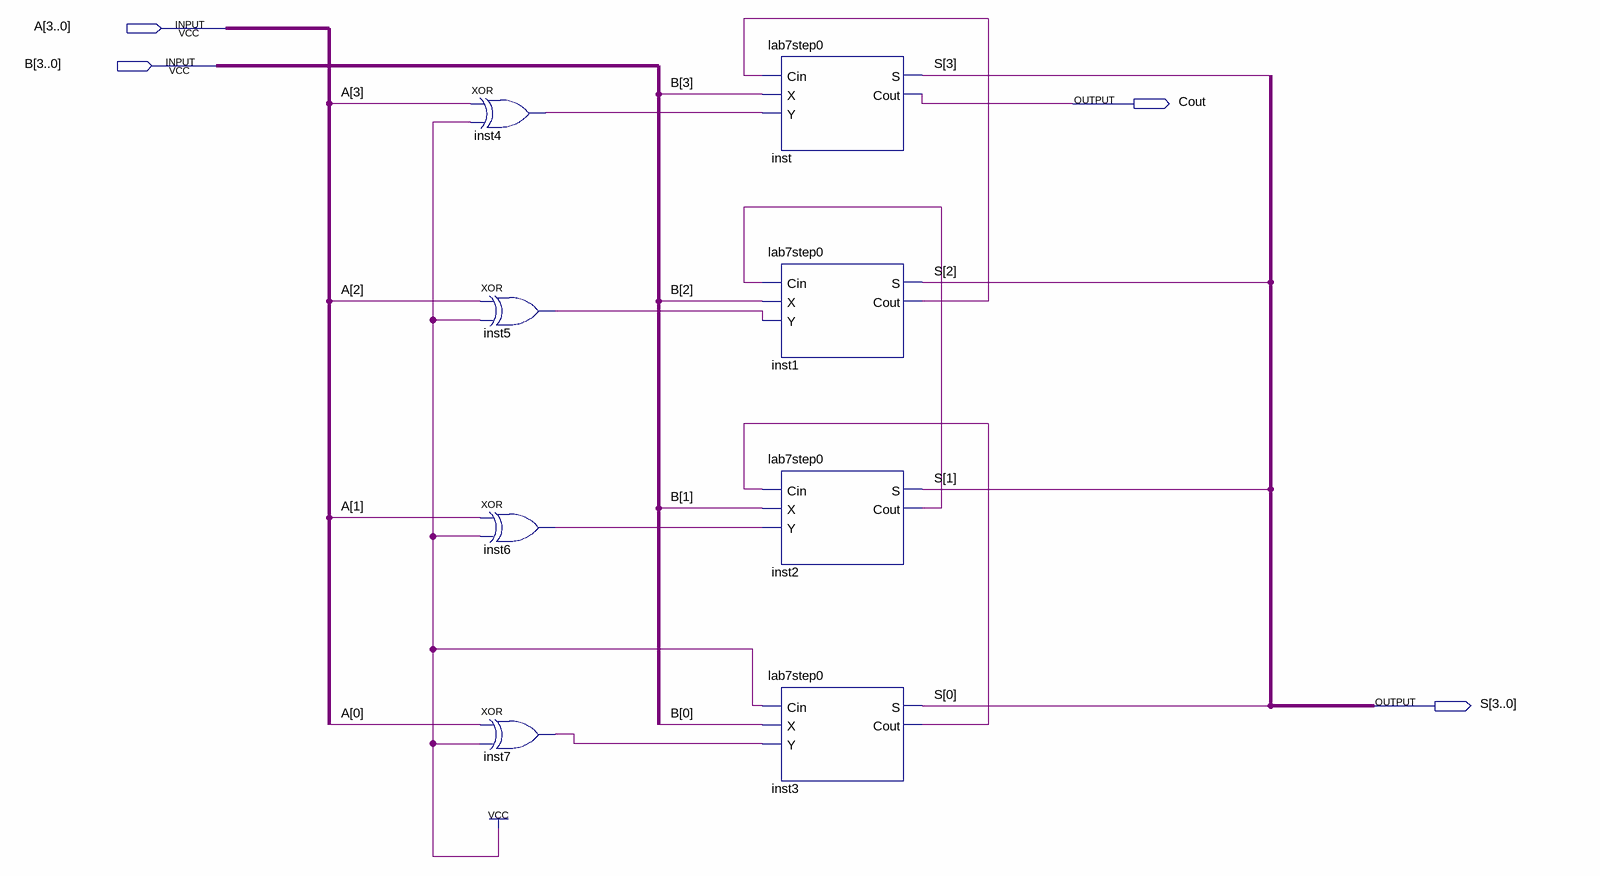
[diagram p0: schematic sheet]
// Quartus schematic 4bitSub.bdf as structural Verilog: 8 symbols, 4 pins
module \4bitSub  (
  input  [3:0] A,
  input  [3:0] B,
  output Cout,
  output [3:0] S
);

  wire inst1_cout, inst2_cout, inst3_cout, inst4_out, inst5_out, inst6_out, inst7_out;

  xor inst4 (inst4_out, A[3], 1'b1);
  xor inst5 (inst5_out, A[2], 1'b1);
  xor inst6 (inst6_out, A[1], 1'b1);
  xor inst7 (inst7_out, A[0], 1'b1);
  lab7step0 inst (.Cin(inst1_cout), .X(B[3]), .Y(inst4_out), .S(S[3]), .Cout(Cout));
  lab7step0 inst1 (.Cin(inst2_cout), .X(B[2]), .Y(inst5_out), .S(S[2]), .Cout(inst1_cout));
  lab7step0 inst2 (.Cin(inst3_cout), .X(B[1]), .Y(inst6_out), .S(S[1]), .Cout(inst2_cout));
  lab7step0 inst3 (.Cin(1'b1), .X(B[0]), .Y(inst7_out), .S(S[0]), .Cout(inst3_cout));
endmodule
